# Altium schematic sheet PCM.SchDoc
size Letter; SheetNumber: 2; SheetTotal: 3
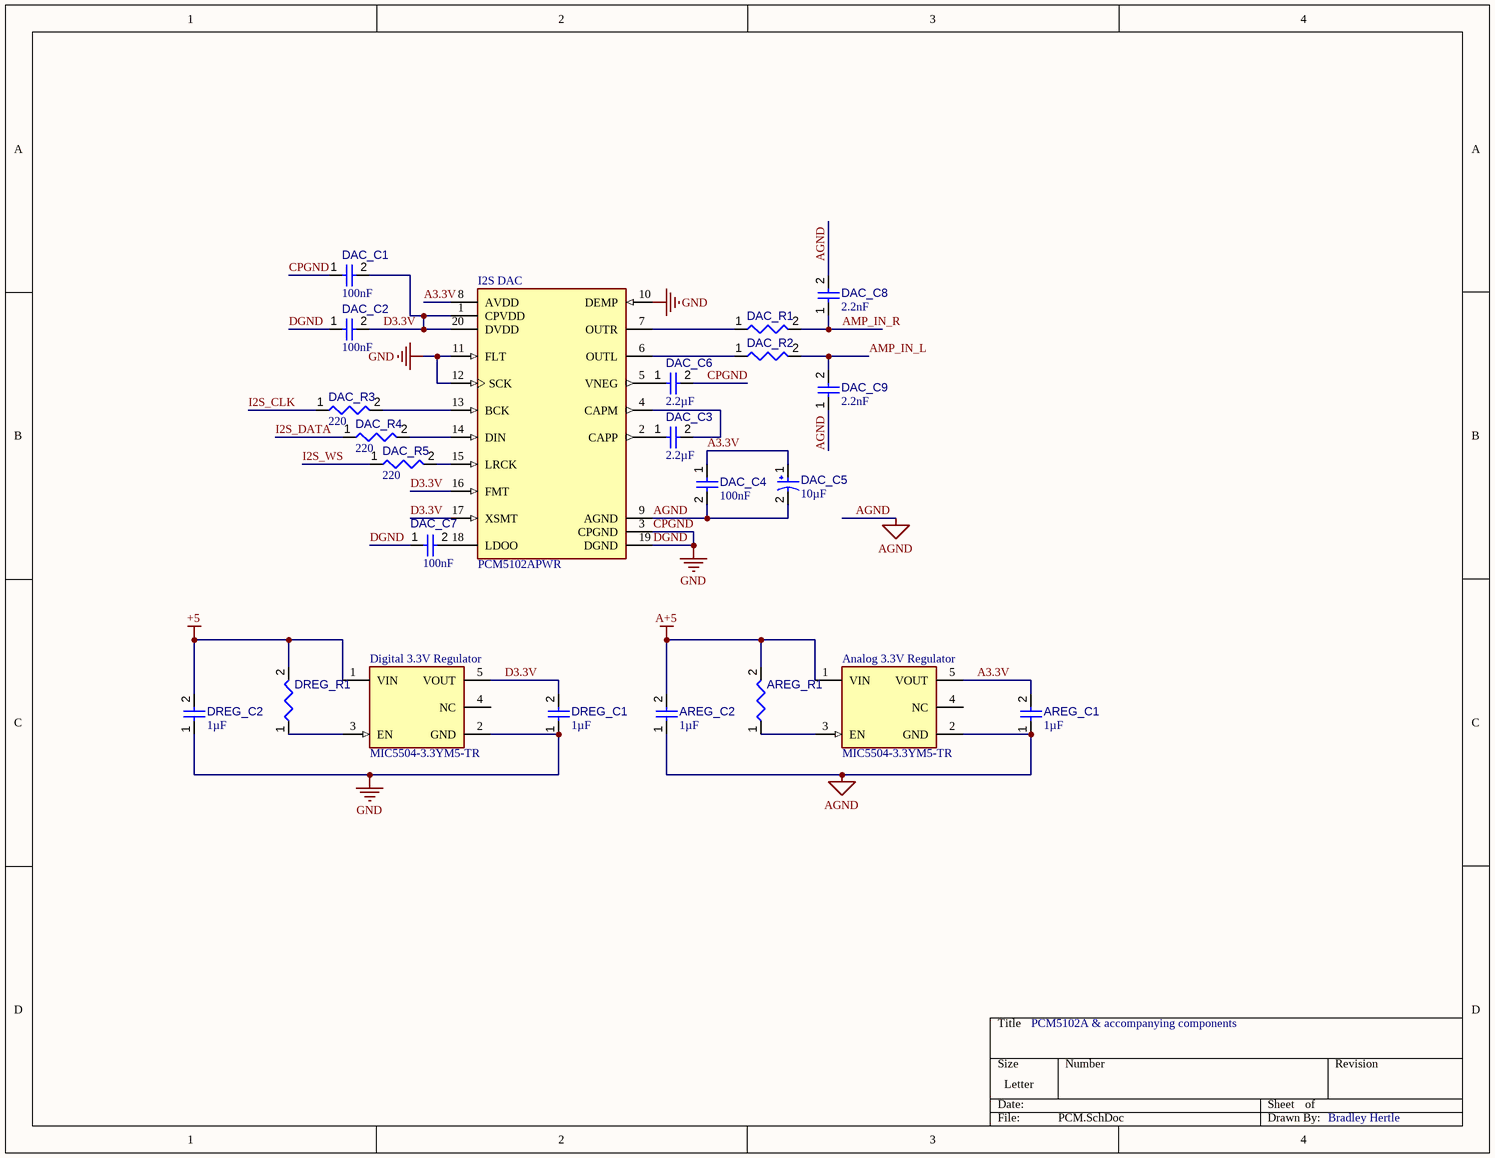
[diagram p0: PCM.SchDoc]

## Parts
Analog_3.3V_Regulator  MIC5504-3.3YM5-TR  [FP-SOT23-5LD-PL-1-IPC_B]
AREG_C1  value 1µF  [CAP_CL05_SAM]  (hidden comment: 1uF 0402 Ceramic)
AREG_C2  value 1µF  [CAP_CL05_SAM]  (hidden comment: 1uF 0402 Ceramic)
AREG_R1  RC0402FR-07220KL  [RESC1005X40X25NL05T10]  (value not drawn)
DAC_C1  value 100nF  [FP-CL278-IPC_A]  (hidden comment: CL05A104KA5NNNC)
DAC_C2  value 100nF  [FP-CL278-IPC_A]  (hidden comment: CL05A104KA5NNNC)
DAC_C3  value 2.2µF  [FP-GRM155-0_05-MFG]  (hidden comment: GRM155R61A225KE01J)
DAC_C4  value 100nF  [FP-CL278-IPC_A]  (hidden comment: CL05A104KA5NNNC)
DAC_C5  value 10µF  [CAPMP3217X18-T_V]  (hidden comment: TAJA106K016RNJ)
DAC_C6  value 2.2µF  [FP-GRM155-0_05-MFG]  (hidden comment: GRM155R61A225KE01J)
DAC_C7  value 100nF  [FP-CL278-IPC_A]  (hidden comment: CL05A104KA5NNNC)
DAC_C8  value 2.2nF  [FP-CL316-IPC_B]  (hidden comment: CL05B222JB5NNNC)
DAC_C9  value 2.2nF  [FP-CL316-IPC_B]  (hidden comment: CL05B222JB5NNNC)
DAC_R1  RC0402FR-07470RL  [RESC1005X40X25NL05T10]  (value not drawn)
DAC_R2  RC0402FR-07470RL  [RESC1005X40X25NL05T10]  (value not drawn)
DAC_R3  value 220  [RESC1608X55X30LL20T10]  (hidden comment: RK73B1JTTD221J)
DAC_R4  value 220  [RESC1608X55X30LL20T10]  (hidden comment: RK73B1JTTD221J)
DAC_R5  value 220  [RESC1608X55X30LL20T10]  (hidden comment: RK73B1JTTD221J)
Digital_3.3V_Regulator  MIC5504-3.3YM5-TR  [FP-SOT23-5LD-PL-1-IPC_B]
DREG_C1  value 1µF  [CAP_CL05_SAM]  (hidden comment: 1uF 0402 Ceramic)
DREG_C2  value 1µF  [CAP_CL05_SAM]  (hidden comment: 1uF 0402 Ceramic)
DREG_R1  RC0402FR-07220KL  [RESC1005X40X25NL05T10]  (value not drawn)
I2S_DAC  PCM5102APWR  [FP-PW0020A-IPC_A]

## Nets
+5: Digital_3.3V_Regulator.1(VIN) DREG_C2.2 DREG_R1.2
A+5: Analog_3.3V_Regulator.1(VIN) AREG_C2.2 AREG_R1.2
AGND: Analog_3.3V_Regulator.2(GND) AREG_C1.1 AREG_C2.1 DAC_C4.2 DAC_C5.2 DAC_C8.2 DAC_C9.1 I2S_DAC.9(AGND)
CPGND: DAC_C1.1 DAC_C2.1 DAC_C6.2 DAC_C7.1 Digital_3.3V_Regulator.2(GND) DREG_C1.1 DREG_C2.1 I2S_DAC.3(CPGND) I2S_DAC.10(DEMP) I2S_DAC.11(FLT) I2S_DAC.12(SCK) I2S_DAC.19(DGND)  [also labelled DGND, GND]
A3.3V: Analog_3.3V_Regulator.5(VOUT) AREG_C1.2 DAC_C4.1 DAC_C5.1 I2S_DAC.8(AVDD)
AMP_IN_L: DAC_C9.2 DAC_R2.2
AMP_IN_R: DAC_C8.1 DAC_R1.2
D3.3V: DAC_C1.2 DAC_C2.2 Digital_3.3V_Regulator.5(VOUT) DREG_C1.2 I2S_DAC.1(CPVDD) I2S_DAC.16(FMT) I2S_DAC.17(XSMT) I2S_DAC.20(DVDD)
I2S_CLK: DAC_R3.1
I2S_DATA: DAC_R4.1
I2S_WS: DAC_R5.1
NetAnalog_3.3V_Regulator_3: Analog_3.3V_Regulator.3(EN) AREG_R1.1
NetDAC_C3_1: DAC_C3.1 I2S_DAC.2(CAPP)
NetDAC_C3_2: DAC_C3.2 I2S_DAC.4(CAPM)
NetDAC_C6_1: DAC_C6.1 I2S_DAC.5(VNEG)
NetDAC_C7_2: DAC_C7.2 I2S_DAC.18(LDOO)
NetDAC_R1_1: DAC_R1.1 I2S_DAC.7(OUTR)
NetDAC_R2_1: DAC_R2.1 I2S_DAC.6(OUTL)
NetDAC_R3_2: DAC_R3.2 I2S_DAC.13(BCK)
NetDAC_R4_2: DAC_R4.2 I2S_DAC.14(DIN)
NetDAC_R5_2: DAC_R5.2 I2S_DAC.15(LRCK)
NetDigital_3.3V_Regulator_3: Digital_3.3V_Regulator.3(EN) DREG_R1.1

Not connected (* = marked no-connect by the designer): Analog_3.3V_Regulator 4(NC); Digital_3.3V_Regulator 4(NC)

## Notes on the sheet
- PCM5102A & accompanying components
- Bradley Hertle

## Library data of the parts
Analog_3.3V_Regulator Digital_3.3V_Regulator = CMP-019-00050-1: Fixed Positive LDO Regulator, 3.3V, 0.38V Dropout, CMOS, PDSO5, use this one; RoHS Compliant: Yes
AREG_C1 AREG_C2 DREG_C1 DREG_C2 = CMP-001-00089-5: CL05A105KO5NNNC, Samsung, Ceramic CAP; Source: CL05A105KO5NNNC.SchLib; Mfr_Name: Samsung; Design Item ID: CL05A105KO5NNNC
AREG_R1 DREG_R1 = CMP-009-00179-1: Fixed Resistor, Metal Glaze/thick Film, 0.0625W, 220000ohm, 50V, 1% +/-Tol, 100ppm/Cel, Surface Mount, 0402; Min Operating Temperature: -55°C; RoHS Compliant: Yes; Max Operating Temperature: 155°C; Tolerance: 1%
DAC_C1 DAC_C2 DAC_C4 DAC_C7 = CMP-001-00088-2: Ceramic Capacitor, Multilayer, Ceramic, 25V, 10% +Tol, 10% -Tol, X5R, 15% TC, 0.1uF, Surface Mount, 0402, 0.1uF cap; RoHS Compliant: Yes; Capacitor Type: Ceramic; Min Operating Temperature: -55°C; Max Operating Temperature: 85°C
DAC_C3 DAC_C6 = CMP-001-00090-1: Ceramic Capacitor, Multilayer, Ceramic, 10V, 10% +Tol, 10% -Tol, X5R, 15% TC, 2.2uF, Surface Mount, 0402
DAC_C5 = CMP-001-00041-7: Standard Tantalum, 10 uF, +/- 10%, 16 V, -55 to 125 degC, 1206 (3216 Metric), RoHS, Tape and Reel; Manufacturer: AVX; Voltage Rating: 16V; ESR: 3Ohm; Datasheet URL: http://datasheets.avx.com/TAJ.pdf; Package URL: http://www.avx.com/download/software/literature/AVX-Footprint-Library.pdf; Pins: 2; Package Reference: CAPMP3217X18-T; RoHS Compliant: True; Case/Package: 1206; Max Operating Temperature: 125°C; Package Description: 2-Pin Surface Mount Device, Body 3.2 x 1.65 mm; Mounting Technology: SM; Tolerance: 10%; Package Quantity: 1; Packaging: TapeandReel; Min Operating Temperature: -55°C; Datasheet Version: Feb-16; Manufacturer URL: http://www.avx.com/; Capacitor Type: Tantalum
DAC_C8 DAC_C9 = CMP-001-00087-2: Ceramic Capacitor, Multilayer, Ceramic, 50V, 5% +Tol, 5% -Tol, X7R, 15% TC, 0.0022uF, Surface Mount, 0402, 2.2nF cap; Capacitor Type: Ceramic; Min Operating Temperature: -55°C; RoHS Compliant: Yes; Max Operating Temperature: 125°C
DAC_R1 DAC_R2 = CMP-009-00181-1: Fixed Resistor, Metal Glaze/thick Film, 0.0625W, 470ohm, 50V, 1% +/-Tol, 100ppm/Cel, Surface Mount, 0402; Tolerance: 1%; Max Operating Temperature: 155°C; RoHS Compliant: Yes; Min Operating Temperature: -55°C
DAC_R3-DAC_R5 = CMP-009-00180-2: Fixed Resistor, Metal Glaze/thick Film, 0.125W, 220ohm, 75V, 5% +/-Tol, 200ppm/Cel, Surface Mount, 0603; Max Operating Temperature: 155°C; RoHS Compliant: Yes; Tolerance: 5%; Min Operating Temperature: -55°C
I2S_DAC = CMP-00027-00004-1: D/A Converter, 1 Func, Serial Input Loading, PDSO20; RoHS Compliant: Yes; Min Operating Temperature: -25°C; Max Operating Temperature: 85°C